# Altium project HIVE_BOARD.PrjPcb (part 5 of 6)

## Sheet HIVE_BOARD_ETHERNET.SchDoc
size Tabloid; SheetNumber: 9; SheetTotal: 12; Size: 11x17; Sheet_Name: ETHERNET
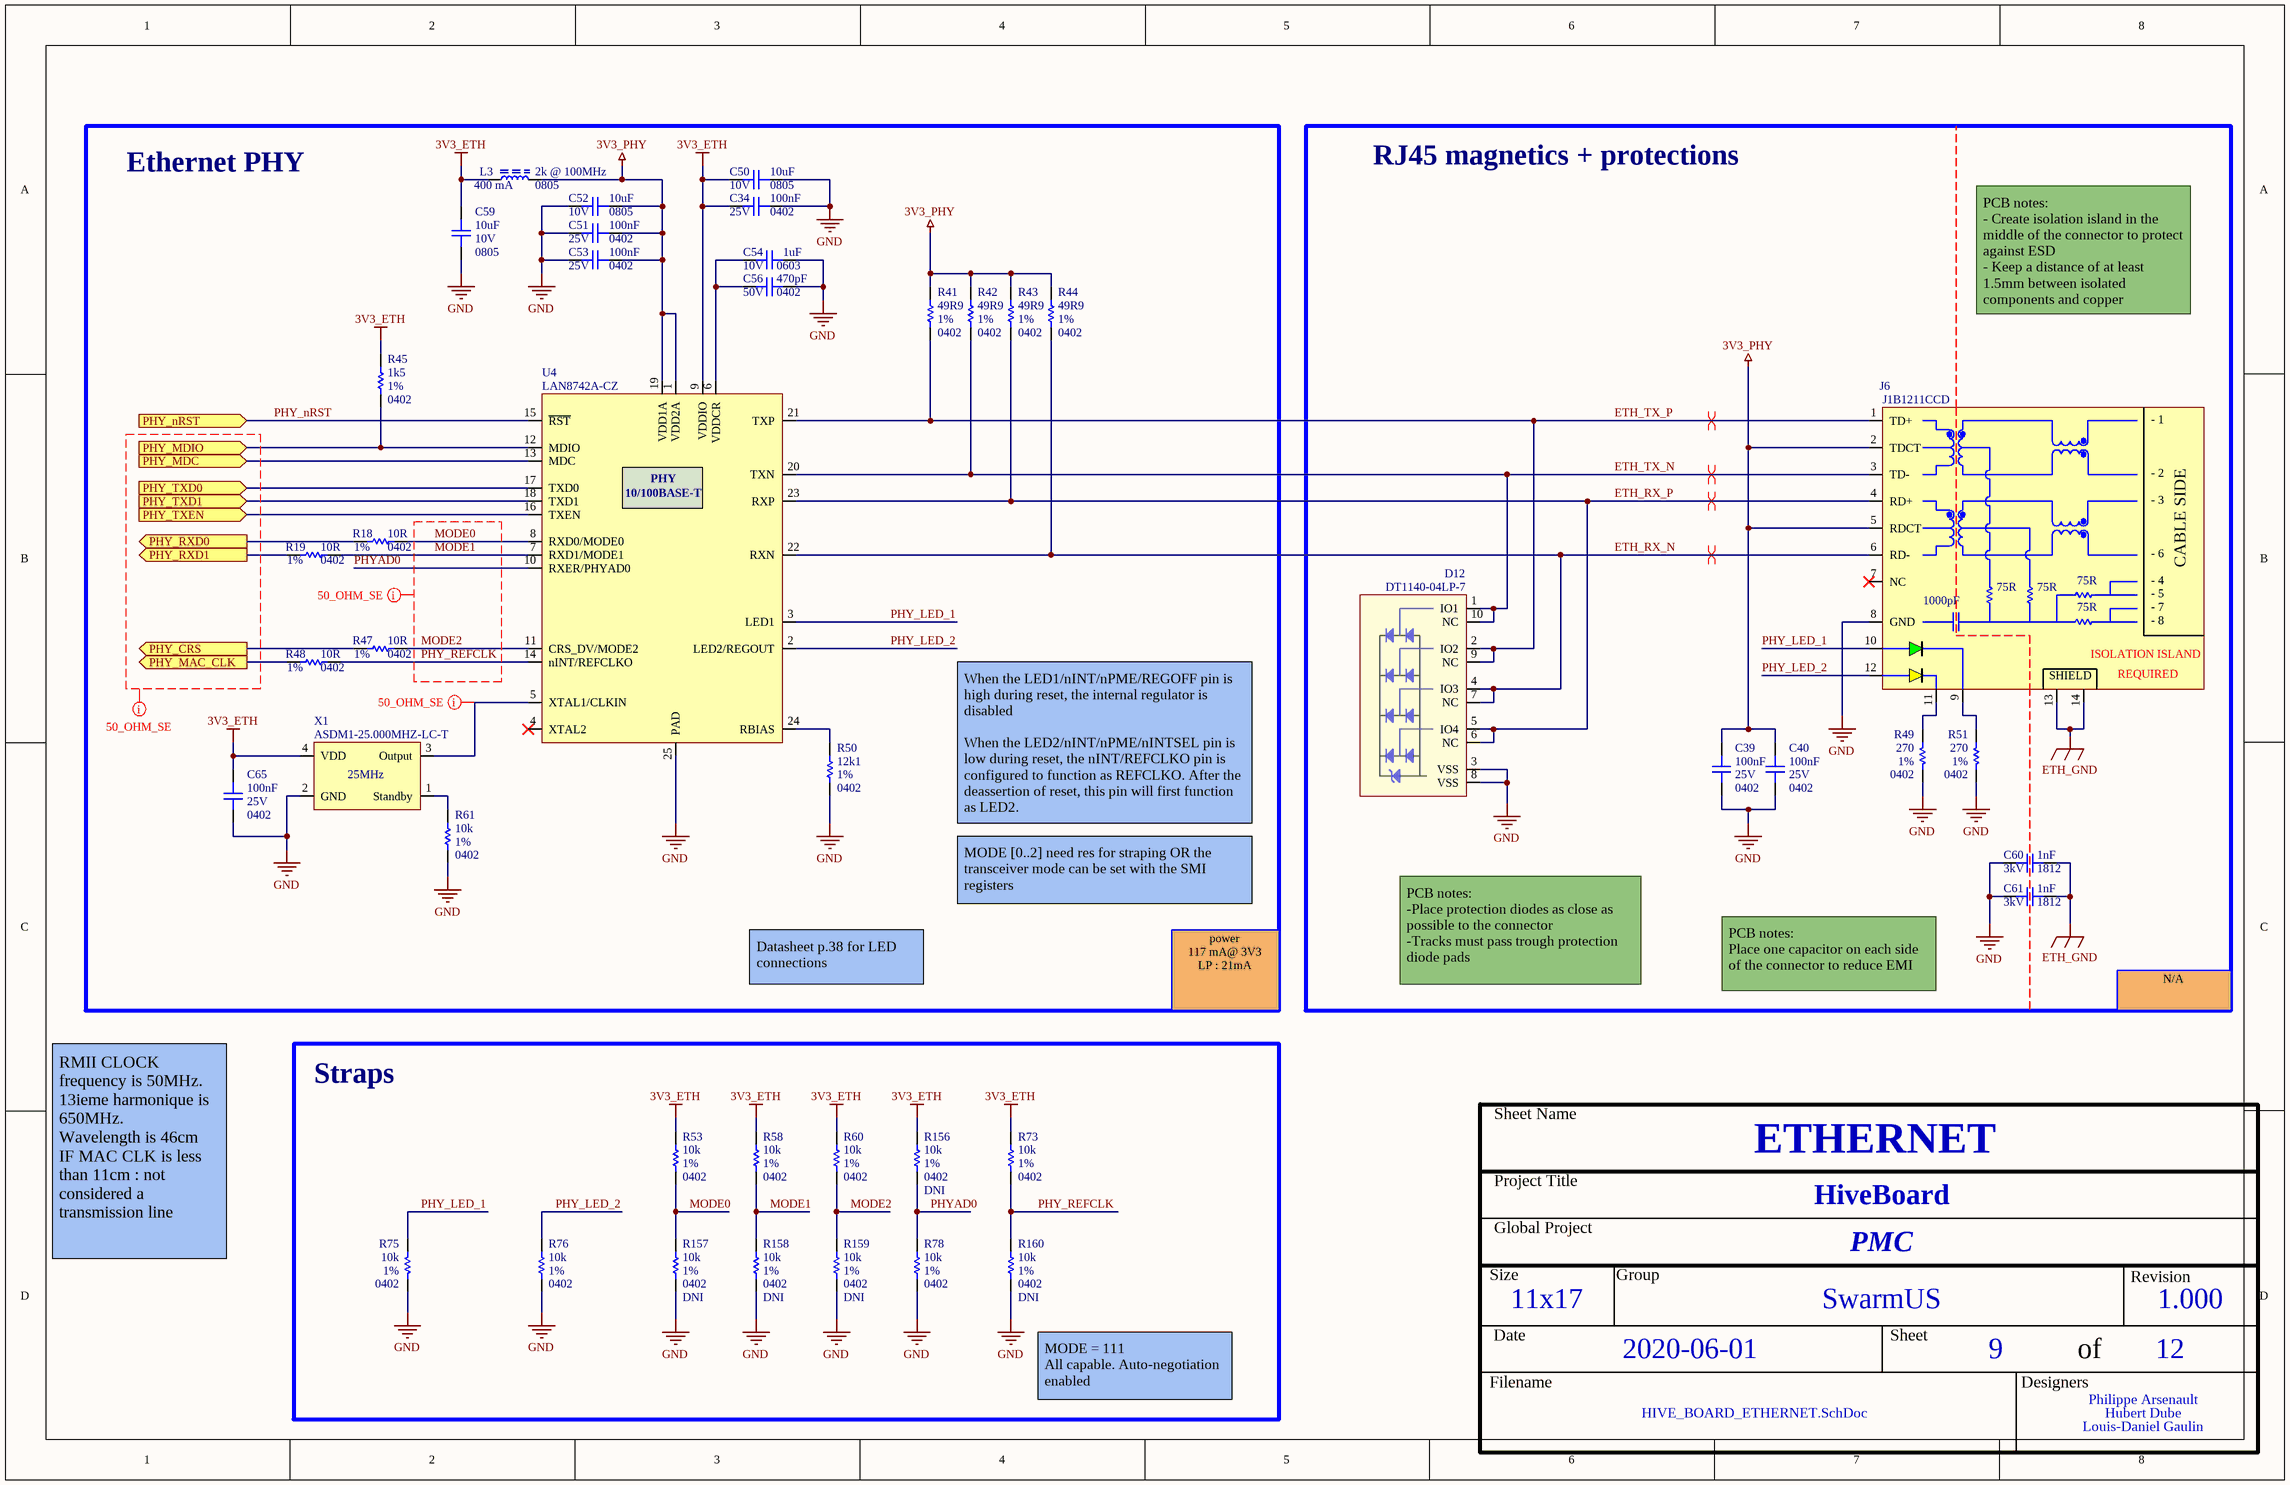
[diagram p8: HIVE_BOARD_ETHERNET.SchDoc]

### Parts
C34  value 100nF  Package: 0402  Voltage Rating: 25V  [CAP_CER_0402]  (hidden comment: CGA2B3X7R1E104K050BB)
C39  value 100nF  Package: 0402  Voltage Rating: 25V  [CAP_CER_0402]  (hidden comment: CGA2B3X7R1E104K050BB)
C40  value 100nF  Package: 0402  Voltage Rating: 25V  [CAP_CER_0402]  (hidden comment: CGA2B3X7R1E104K050BB)
C50  value 10uF  Package: 0805  Voltage Rating: 10V  [CAP_CER_0805]  (hidden comment: LMK212BJ106KG-T)
C51  value 100nF  Package: 0402  Voltage Rating: 25V  [CAP_CER_0402]  (hidden comment: CGA2B3X7R1E104K050BB)
C52  value 10uF  Package: 0805  Voltage Rating: 10V  [CAP_CER_0805]  (hidden comment: LMK212BJ106KG-T)
C53  value 100nF  Package: 0402  Voltage Rating: 25V  [CAP_CER_0402]  (hidden comment: CGA2B3X7R1E104K050BB)
C54  value 1uF  Package: 0603  Voltage Rating: 10V  [CAP_CER_0603]  (hidden comment: C0603C105K8PACTU)
C56  value 470pF  Package: 0402  Voltage Rating: 50V  [CAP_CER_0402]  (hidden comment: CC0402KRX7R9BB471)
C59  value 10uF  Package: 0805  Voltage Rating: 10V  [CAP_CER_0805]  (hidden comment: LMK212BJ106KG-T)
C60  value 1nF  Package: 1812  Voltage Rating: 3kV  [CAP_CER_1812]  (hidden comment: 885342211009)
C61  value 1nF  Package: 1812  Voltage Rating: 3kV  [CAP_CER_1812]  (hidden comment: 885342211009)
C65  value 100nF  Package: 0402  Voltage Rating: 25V  [CAP_CER_0402]  (hidden comment: CGA2B3X7R1E104K050BB)
D12  DT1140-04LP-7  [TVS_DATA_DT1140-04LP-7]
J6  J1B1211CCD  [CON_ETH_J1B1211CCD_WIZ]
L3  value 2k @ 100MHz  Current Rating: 400 mA  Package: 0805  [FER_0805]  (hidden comment: MMZ2012Y202BT000)
R18  value 10R  Tolerance: 1%  Package: 0402  [RES_0402]  (hidden comment: RMCF0402FT10R0)
R19  value 10R  Tolerance: 1%  Package: 0402  [RES_0402]  (hidden comment: RMCF0402FT10R0)
R41  value 49R9  Tolerance: 1%  Package: 0402  [RES_0402]  (hidden comment: RC0402FR-0749R9L)
R42  value 49R9  Tolerance: 1%  Package: 0402  [RES_0402]  (hidden comment: RC0402FR-0749R9L)
R43  value 49R9  Tolerance: 1%  Package: 0402  [RES_0402]  (hidden comment: RC0402FR-0749R9L)
R44  value 49R9  Tolerance: 1%  Package: 0402  [RES_0402]  (hidden comment: RC0402FR-0749R9L)
R45  value 1k5  Tolerance: 1%  Package: 0402  [RES_0402]  (hidden comment: RC0402FR-071K5L)
R47  value 10R  Tolerance: 1%  Package: 0402  [RES_0402]  (hidden comment: RMCF0402FT10R0)
R48  value 10R  Tolerance: 1%  Package: 0402  [RES_0402]  (hidden comment: RMCF0402FT10R0)
R49  value 270  Tolerance: 1%  Package: 0402  [FER_0402]  (hidden comment: RC0402FR-07270RL)
R50  value 12k1  Tolerance: 1%  Package: 0402  [RES_0402]  (hidden comment: RC0402FR-0712K1L)
R51  value 270  Tolerance: 1%  Package: 0402  [FER_0402]  (hidden comment: RC0402FR-07270RL)
R53  value 10k  Tolerance: 1%  Package: 0402  [RES_0402]  (hidden comment: RC0402FR-0710KL)
R58  value 10k  Tolerance: 1%  Package: 0402  [RES_0402]  (hidden comment: RC0402FR-0710KL)
R60  value 10k  Tolerance: 1%  Package: 0402  [RES_0402]  (hidden comment: RC0402FR-0710KL)
R61  value 10k  Tolerance: 1%  Package: 0402  [RES_0402]  (hidden comment: RC0402FR-0710KL)
R73  value 10k  Tolerance: 1%  Package: 0402  [RES_0402]  (hidden comment: RC0402FR-0710KL)
R75  value 10k  Tolerance: 1%  Package: 0402  [RES_0402]  (hidden comment: RC0402FR-0710KL)
R76  value 10k  Tolerance: 1%  Package: 0402  [RES_0402]  (hidden comment: RC0402FR-0710KL)
R78  value 10k  Tolerance: 1%  Package: 0402  [RES_0402]  (hidden comment: RC0402FR-0710KL)
R156  value 10k  Tolerance: 1%  Assembly Note: DNI  Package: 0402  [RES_0402]  (hidden comment: RC0402FR-0710KL)
R157  value 10k  Tolerance: 1%  Assembly Note: DNI  Package: 0402  [RES_0402]  (hidden comment: RC0402FR-0710KL)
R158  value 10k  Tolerance: 1%  Assembly Note: DNI  Package: 0402  [RES_0402]  (hidden comment: RC0402FR-0710KL)
R159  value 10k  Tolerance: 1%  Assembly Note: DNI  Package: 0402  [RES_0402]  (hidden comment: RC0402FR-0710KL)
R160  value 10k  Tolerance: 1%  Assembly Note: DNI  Package: 0402  [RES_0402]  (hidden comment: RC0402FR-0710KL)
U4  LAN8742A-CZ  [COM_ETH_LAN8742A-CZ-TR]
X1  ASDM1-25.000MHZ-LC-T  [OSC_CRY_ASDM1-25.000MHZ-LC-T]

### Blocks framed on the sheet
Ethernet PHY: C34 C50-C54 C56 C59 C65 L3 R18 R19 R41-R45 R47 R48 R50 R61 U4 X1
RJ45 magnetics + protections: C39 C40 C60 C61 D12 J6 R49 R51
Straps: R53 R58 R60 R73 R75 R76 R78 R156-R160

### Ports
PHY_CRS (out), PHY_MAC_CLK (out), PHY_MDC (in), PHY_MDIO (in), PHY_nRST (in), PHY_RXD0 (out), PHY_RXD1 (out), PHY_TXD0 (in), PHY_TXD1 (in), PHY_TXEN (in)

### Nets
3V3_ETH: C34.2 C50.2 C59.2 C65.1 L3.1 R45.2 R53.2 R58.2 R60.2 R73.2 R156.2 U4.9(VDDIO) X1.4(VDD)
3V3_PHY: C39.1 C40.1 C51.1 C52.1 C53.1 J6.2(TDCT) J6.5(RDCT) L3.2 R41.2 R42.2 R43.2 R44.2 U4.1(VDD2A) U4.19(VDD1A)
ETH_GND: C60.1 C61.1 J6.13(SHIELD) J6.14
GND: C34.1 C39.2 C40.2 C50.1 C51.2 C52.2 C53.2 C54.1 C56.1 C59.1 C60.2 C61.2 C65.2 D12.3(VSS) D12.8(VSS) J6.8(GND) R49.1 R50.1 R51.1 R61.1 R75.1 R76.1 R78.1 R157.1 R158.1 R159.1 R160.1 U4.25(PAD) X1.2(GND)
ETH_RX_N: D12.4(IO3) D12.7(NC) J6.6(RD-) R44.1 U4.22(RXN)
ETH_RX_P: D12.5(IO4) D12.6(NC) J6.4(RD+) R43.1 U4.23(RXP)
ETH_TX_N: D12.1(IO1) D12.10(NC) J6.3(TD-) R42.1 U4.20(TXN)
ETH_TX_P: D12.2(IO2) D12.9(NC) J6.1(TD+) R41.1 U4.21(TXP)
MODE0: R18.1 R53.1 R157.2 U4.8(RXD0/MODE0)
MODE1: R19.1 R58.1 R158.2 U4.7(RXD1/MODE1)
MODE2: R47.1 R60.1 R159.2 U4.11(CRS_DV/MODE2)
PHY_LED_1: J6.10(LED1_A) R75.2 U4.3(LED1)
PHY_LED_2: J6.12 R76.2 U4.2(LED2/REGOUT)
PHY_nRST: U4.15(~{RST}) ; port PHY_nRST
PHY_REFCLK: R48.1 R73.1 R160.2 U4.14(nINT/REFCLKO)
PHYAD0: R78.2 R156.1 U4.10(RXER/PHYAD0)
NetC54_2: C54.2 C56.2 U4.6(VDDCR)
NetJ6_9: J6.9(LED1_K) R51.2
NetJ6_11: J6.11 R49.2
NetR18_2: R18.2 ; port PHY_RXD0
NetR19_2: R19.2 ; port PHY_RXD1
NetR45_1: R45.1 U4.12(MDIO) ; port PHY_MDIO
NetR47_2: R47.2 ; port PHY_CRS
NetR48_2: R48.2 ; port PHY_MAC_CLK
NetR50_2: R50.2 U4.24(RBIAS)
NetR61_2: R61.2 X1.1(Standby)
NetR165_1: U4.17(TXD0) ; port PHY_TXD0
NetR167_1: U4.18(TXD1) ; port PHY_TXD1
NetU1_29: U4.13(MDC) ; port PHY_MDC
NetU1_67: U4.16(TXEN) ; port PHY_TXEN
NetU4_5: U4.5(XTAL1/CLKIN) X1.3(Output)

Not connected (* = marked no-connect by the designer): J6 7(NC)*; U4 4(XTAL2)*

### Layout directives
differential pair; differential pair class DIFF_100: ETH_RX_N, ETH_RX_P, ETH_TX_N, ETH_TX_P
net class SE_50: (no net found under the mark), MODE0, MODE1, MODE2, NetU4_5, PHY_REFCLK

### Notes on the sheet
- PCB notes:
  - Create isolation island in the middle of the connector to protect against ESD
  - Keep a distance of at least 1.5mm between isolated components and copper
- When the LED1/nINT/nPME/REGOFF pin is high during reset, the internal regulator is disabled
  When the LED2/nINT/nPME/nINTSEL pin is low during reset, the nINT/REFCLKO pin is configured to function as REFCLKO. After the deassertion of reset, this pin will first function as LED2.
- MODE [0..2] need res for straping OR the transceiver mode can be set with the SMI registers
- Datasheet p.38 for LED connections
- power
  117 mA@ 3V3
  LP : 21mA
- PCB notes:
  -Place protection diodes as close as possible to the connector
  -Tracks must pass trough protection diode pads
- PCB notes:
  Place one capacitor on each side of the connector to reduce EMI
- N/A
- RMII CLOCK frequency is 50MHz. 13ieme harmonique is 650MHz.
  Wavelength is 46cm
  IF MAC CLK is less than 11cm : not considered a transmission line
- MODE = 111
  All capable. Auto-negotiation enabled
- Sheet Name
- Project Title
- Global Project
- Size
- Group
- Revision
- Date
- Sheet
- of
- Filename
- Designers
- (in symbol COM_ETH_LAN8742A-CZ) PHY; 10/100BASE-T
- (in symbol CON_ETH_J1B1211CCD) - 1; - 2; - 3; - 6; CABLE SIDE; 75R; - 4; - 5; 1000pF; - 7; - 8; ISOLATION ISLAND; REQUIRED
- (in symbol OSC_CRY_ASDM1-25.000MHZ-LC-T) 25MHz

### Library data of the parts
C34 C39 C40 C51 C53 C65 = CAP_CER_CGA2B3X7R1E104K050BB: CAP - CER 0.1µF 10% 25V X7R - 0402; Manufacturer #1: TDK Corporation; GRAMS Lib Spec: 2.8; Magnetic Material: Unknown; Polarized: NO; Assembly Type: SMD; CreatedBy/Date: Nicolas Roy 2018-11-07; Current Rating: *; HelpURL: https://product.tdk.com/info/en/catalog/datasheets/mlcc_automotive_general_en.pdf; Manufacturer #2: *; Note: *; Part Number #1: CGA2B3X7R1E104K050BB; Part Number #2: *; Power Max: *; Temperature: -55°C ~ 125°C; Tolerance: 10%; VerifiedBy: Nicolas V. (2019-01-22); Supplier 1: Digi-Key; Supplier Part Number 1: 445-6902-1-ND; Cryo: UNKNOWN
C50 C52 C59 = CAP_CER_LMK212BJ106KG-T: CAP - CER 10UF 10% 10V X5R - 0805; Manufacturer #1: Taiyo Yuden; GRAMS Lib Spec: 2.8; Magnetic Material: Unknown; Polarized: NO; Assembly Type: SMD; CreatedBy/Date: Caroline Paulin / 25 juillet 2018; Current Rating: *; HelpURL: https://www.yuden.co.jp/productdata/catalog/mlcc_all_e.pdf; Manufacturer #2: *; Note: *; Part Number #1: LMK212BJ106KG-T; Part Number #2: *; Power Max: *; Temperature: -55°C ~ 85°C; Tolerance: 10%; VerifiedBy: Nicolas V. (2019-01-22); Supplier 1: Digi-Key; Supplier Part Number 1: 587-1300-1-ND; Cryo: UNKNOWN
C54 = CAP_CER_C0603C105K8PACTU: CAP - CER 1uF 10V 10% X5R - 0603; Manufacturer #1: KEMET; GRAMS Lib Spec: 2.8; Magnetic Material: Unknown; Polarized: NO; Tolerance: 10%; Current Rating: *; Power Max: *; HelpURL: https://content.kemet.com/datasheets/KEM_C1006_X5R_SMD.pdf; CreatedBy/Date: Hubert Dube - 21/07/20; VerifiedBy: Louis-Daniel Gaulin - 21/07/20; Temperature: -55°C ~ 85°C; Manufacturer #2: *; Assembly Type: SMD; Part Number #2: *; Part Number #1: C0603C105K8PACTU; Cryo: UNKNOWN; Supplier 1: Digi-Key; Supplier Part Number 1: 399-3118-1-ND
C56 = CAP_CER_CC0402KRX7R9BB471: CAP - CER 470pF 10% 50V X7R - 0402; Manufacturer #1: Yageo; GRAMS Lib Spec: 2.8; Magnetic Material: Unknown; Polarized: NO; Assembly Type: SMD; CreatedBy/Date: Nicolas Roy 2018-10-17; Current Rating: *; HelpURL: http://www.yageo.com/documents/recent/UPY-GPHC_X7R_6.3V-to-50V_18.pdf; Manufacturer #2: *; Part Number #1: CC0402KRX7R9BB471; Part Number #2: *; Power Max: *; Temperature: -55°C ~ 125°C; Tolerance: 10%; VerifiedBy: Caroline Paulin - 18 janv 2019; Supplier 1: Digi-Key; Supplier Part Number 1: 311-1028-1-ND; Cryo: UNKNOWN
C60 C61 = CAP_CER_885342211009: CAP - CER 1000pF ±10% 3000V X7R; Manufacturer #1: Würth Elektronik; GRAMS Lib Spec: 2.8; Magnetic Material: Unknown; Polarized: No; Tolerance: 10%; Current Rating: *; Power Max: *; HelpURL: https://www.we-online.de/katalog/datasheet/885342211009.pdf; CreatedBy/Date: Hubert Dube - 03/02/2021; VerifiedBy: Philippe Asenault - 08-02-2021; Temperature: -55°C ~ 125°C; Manufacturer #2: *; Note: *; Assembly Type: SMD; Part Number #2: *; Part Number #1: 885342211009; Cryo: UNKNOWN; Supplier 1: Digi-Key; Supplier Part Number 1: 732-12109-1-ND
D12 = TVS_DATA_DT1140-04LP-7: TVS - DIODE 5.5V 10V - 10-UFDFN; Manufacturer #1: Diodes Incorporated; Value: 5.5V @ 1mA (Reverse Standoff); Voltage Rating: 6V (Breakdown); Current Rating: 6A (8/20µs); Power Max: 60W (8/20µs); GRAMS Lib Spec: 2.8; Note: Fooprint created from tpd4e05u06 (TI) for manufacturability (soldermask); Magnetic Material: Unknown; Polarized: Yes; Tolerance: -; HelpURL: https://www.diodes.com/assets/Datasheets/DT1140-04LP.pdf; CreatedBy/Date: Joël Lemay 2019-11-20; VerifiedBy: C.Paulin - 21/11/2019; Temperature: -55°C~85°C; Package: 10-UFDFN; Manufacturer #2: -; Assembly Type: SMD; Part Number #2: -; Part Number #1: DT1140-04LP-7; Supplier 1: Digi-Key; Supplier Part Number 1: DT1140-04LP-7DICT-ND; Cryo: UNKNOWN
J6 = CON_ETH_J1B1211CCD: CON_ETH - 1 Port RJ45 Magjack Connector Through Hole 10/100 Base-T, AutoMDIX / 350 µH minimum OCL with 8 mA bias current.; Manufacturer #1: WIZnet; Part Number #1: 1278-1052-ND; GRAMS Lib Spec: 2.8; Magnetic Material: Unknown; Polarized: Yes; Tolerance: *; Voltage Rating: *; Power Max: *; HelpURL: http://wizwiki.net/wiki/lib/exe/fetch.php?media=products:wiz550web:wiz550webds_kr:j1b1211ccd.pdf; CreatedBy/Date: Hubert Dube - 12/02/2021; VerifiedBy: Philippe Arsenault - 2021-03-10; Temperature: -40°C ~ 85°C; Assembly Type: SMD; Part Number #2: *; Cryo: UNKNOWN; Supplier 1: Digi-Key; Supplier Part Number 1: 1278-1052-ND
L3 = FER_MMZ2012Y202BT000: FER - FERRITE BEAD 2 KOHM @ 100 MHz 400 mA - 0805; Manufacturer #1: TDK Corporation; GRAMS Lib Spec: 2.8; Magnetic Material: Unknown; Polarized: No; Tolerance: *; Voltage Rating: *; Power Max: *; HelpURL: https://product.tdk.com/info/en/catalog/datasheets/beads_commercial_signal_mmz2012_en.pdf; CreatedBy/Date: Hubert Dube - 7/02/2021; VerifiedBy: Philippe Arsenault/ 2021-03-13; Temperature: -55°C ~ 125°C; Assembly Type: SMD; Part Number #2: *; Part Number #1: MMZ2012Y202BT000; Cryo: UNKNOWN; Supplier 1: Digi-Key; Supplier Part Number 1: 445-1561-1-ND
R18 R19 R47 R48 = RES_RMCF0402FT10R0: RES - 10R 1% 1/16W - 0402; Manufacturer #1: Stackpole Electronics Inc.; Current Rating: 1A; GRAMS Lib Spec: 2.8; Magnetic Material: Unknown; Polarized: No; Voltage Rating: 50V; Assembly Type: SMD; CreatedBy/Date: Joel Lemay 2018-07-04; HelpURL: https://www.seielect.com/Catalog/SEI-RMCF_RMCP.pdf; Manufacturer #2: Panasonic; Part Number #1: RMCF0402FT10R0; Part Number #2: ERJ-2RKF10R0X; Power Max: 1/16W; Temperature: -55°C ~ 155°C; VerifiedBy: Caroline Paulin - 6 sept 2018; Supplier 1: Digi-Key; Supplier Part Number 1: RMCF0402FT10R0CT-ND; Cryo: UNKNOWN
R41-R44 = RES_RC0402FR-0749R9L: RES - 49.9 R ±1% 1/16W -  0402; Manufacturer #1: Yageo; GRAMS Lib Spec: 2.8c; Magnetic Material: Unknown; Polarized: No; Voltage Rating: 50V; Assembly Type: SMD; CreatedBy/Date: Hubert Dubé - 3/02/2020; Current Rating: *; HelpURL: https://www.yageo.com/upload/media/product/productsearch/datasheet/rchip/PYu-RC_Group_51_RoHS_L_11.pdf; Manufacturer #2: *; Note: *; Part Number #1: RC0402FR-0749R9L; Part Number #2: *; Power Max: 1/16W; Temperature: -55°C ~ 155°C; VerifiedBy: Philippe Arsenault/2021-02-08; Supplier 1: Digi-Key; Supplier Part Number 1: 311-49.9LRCT-ND
R45 = RES_RC0402FR-071K5L: RES - 1.5K 1% 1/16W - 0402; Manufacturer #1: Yageo; GRAMS Lib Spec: 2.8c; Magnetic Material: Unknown; Polarized: No; Voltage Rating: 50V; Assembly Type: SMD; CreatedBy/Date: Philippe Arsenault/21 Janvier 2020; Current Rating: -; HelpURL: https://www.yageo.com/upload/media/product/productsearch/datasheet/rchip/PYu-RC_Group_51_RoHS_L_10.pdf; Manufacturer #2: -; Note: -; Part Number #1: RC0402FR-071K5L; Part Number #2: -; Power Max: 1/16W; Temperature: -55°C ~ 155°C; VerifiedBy: C.Paulin - 28/01/2020; Supplier 1: Digi-Key; Supplier Part Number 1: 311-1.50KLRCT-ND; Cryo: UNKNOWN
R49 R51 = RES_RC0402FR-07270RL: RES - 270R 1% 1/16W - 0402; Manufacturer #1: Yageo; GRAMS Lib Spec: 2.8c; Magnetic Material: Unknown; Polarized: No; Voltage Rating: 50V; Assembly Type: SMD; CreatedBy/Date: Philippe Arsenault 2020-07-24; Current Rating: *; HelpURL: https://www.yageo.com/upload/media/product/productsearch/datasheet/rchip/PYu-RC_Group_51_RoHS_L_10.pdf; Manufacturer #2: *; Note: *; Part Number #1: RC0402FR-07270RL; Part Number #2: *; Power Max: 1/16W; Temperature: -55°C ~ 155°C; VerifiedBy: Louis-Daniel Gaulin / 03-10-2020; Supplier 1: Digi-Key; Supplier Part Number 1: 311-270LRCT-ND
R50 = RES_RC0402FR-0712K1L: RES - 12K1 ±1% 1/16W - 0402; Manufacturer #1: Yageo; GRAMS Lib Spec: 2.8c; Magnetic Material: Unknown; Polarized: No; Voltage Rating: 50V; Assembly Type: SMD; CreatedBy/Date: Hubert Dubé - 7/02/2020; Current Rating: *; HelpURL: https://www.yageo.com/upload/media/product/productsearch/datasheet/rchip/PYu-RC_Group_51_RoHS_L_11.pdf; Manufacturer #2: *; Note: *; Part Number #1: RC0402FR-0712K1L; Part Number #2: *; Power Max: 1/16W; Temperature: -55°C ~ 155°C; VerifiedBy: Philippe Arsenault/2021-02-08; Supplier 1: Digi-Key; Supplier Part Number 1: 311-12.1KLRCT-ND
R53 R58 R60 R61 R73 R75 R76 R78 R156-R160 = RES_RC0402FR-0710KL: RES - 10K OHMS 1% 1/16W - 0402; Manufacturer #1: Yageo; GRAMS Lib Spec: 2.8; Magnetic Material: UNKNOWN; Polarized: NO; Voltage Rating: 50V; Assembly Type: SMD; CreatedBy/Date: Nicolas V. (2018-11-20); Current Rating: *; HelpURL: http://www.yageo.com/documents/recent/PYu-RC_Group_51_RoHS_L_9.pdf; Manufacturer #2: *; Note: *; Part Number #1: RC0402FR-0710KL; Part Number #2: *; Power Max: 1/16W; Temperature: -55°C ~ 155°C; VerifiedBy: Nicolas V. (2018-11-20); Supplier 1: Digi-Key; Supplier Part Number 1: 311-10.0KLRCT-ND; Cryo: UNKNOWN
U4 = COM_ETH_LAN8742A-CZ: COM_ETH_ Ethernet PHY 1/1 Transceiver  Ethernet 24-SQFN (4x4) 10/100 BASE-T; Manufacturer #1: Microchip Technology; Voltage Rating: 1.6 ~ 3.6V; GRAMS Lib Spec: 2.7; Magnetic Material: Unknown; Polarized: Yes; Value: *; Tolerance: *; Current Rating: *; Power Max: *; HelpURL: https://ww1.microchip.com/downloads/en/DeviceDoc/DS_LAN8742_00001989A.pdf; VerifiedBy: Philippe Arsenault 2021-03-10; Temperature: 0°C ~ 70°C; Package: 24-SQFN (4x4); Manufacturer #2: *; Note: *; Assembly Type: SMD; Part Number #2: *; Part Number #1: LAN8742A-CZ; CreatedBy/Date: Hubert Dube -  28/01/2021; Supplier 1: Digi-Key; Supplier Part Number 1: LAN8742A-CZ-ND
X1 = OSC_CRY_ASDM1-25.000MHZ-LC-T: OSC_CRY - 25MHz +-50ppm LVCMOS Crystal; Manufacturer #1: Abracon LLC; Voltage Rating: 3.0 ~ 3.6V; Current Rating: 15mA; Power Max: 50mW; GRAMS Lib Spec: 2.8; Magnetic Material: Unknown; Polarized: YES; Value: 25.000MHz; HelpURL: https://abracon.com/Oscillators/ASDM.pdf; CreatedBy/Date: Philippe Arsenault/2021-04-07; VerifiedBy: Louis-Daniel Gaulin / 08-04-2021; Temperature: -40°C ~ 85°C; Package: 4-SMD; Assembly Type: SMD; Part Number #1: ASDM1-25.000MHZ-LC-T; Supplier 1: Digi-Key; Supplier Part Number 1: 535-9792-1-ND

## Sheet HIVE_BOARD_WIRELESS.SchDoc
size Tabloid; SheetNumber: 11; SheetTotal: 12; Sheet_Name: WIRELESS; Size: 11x17
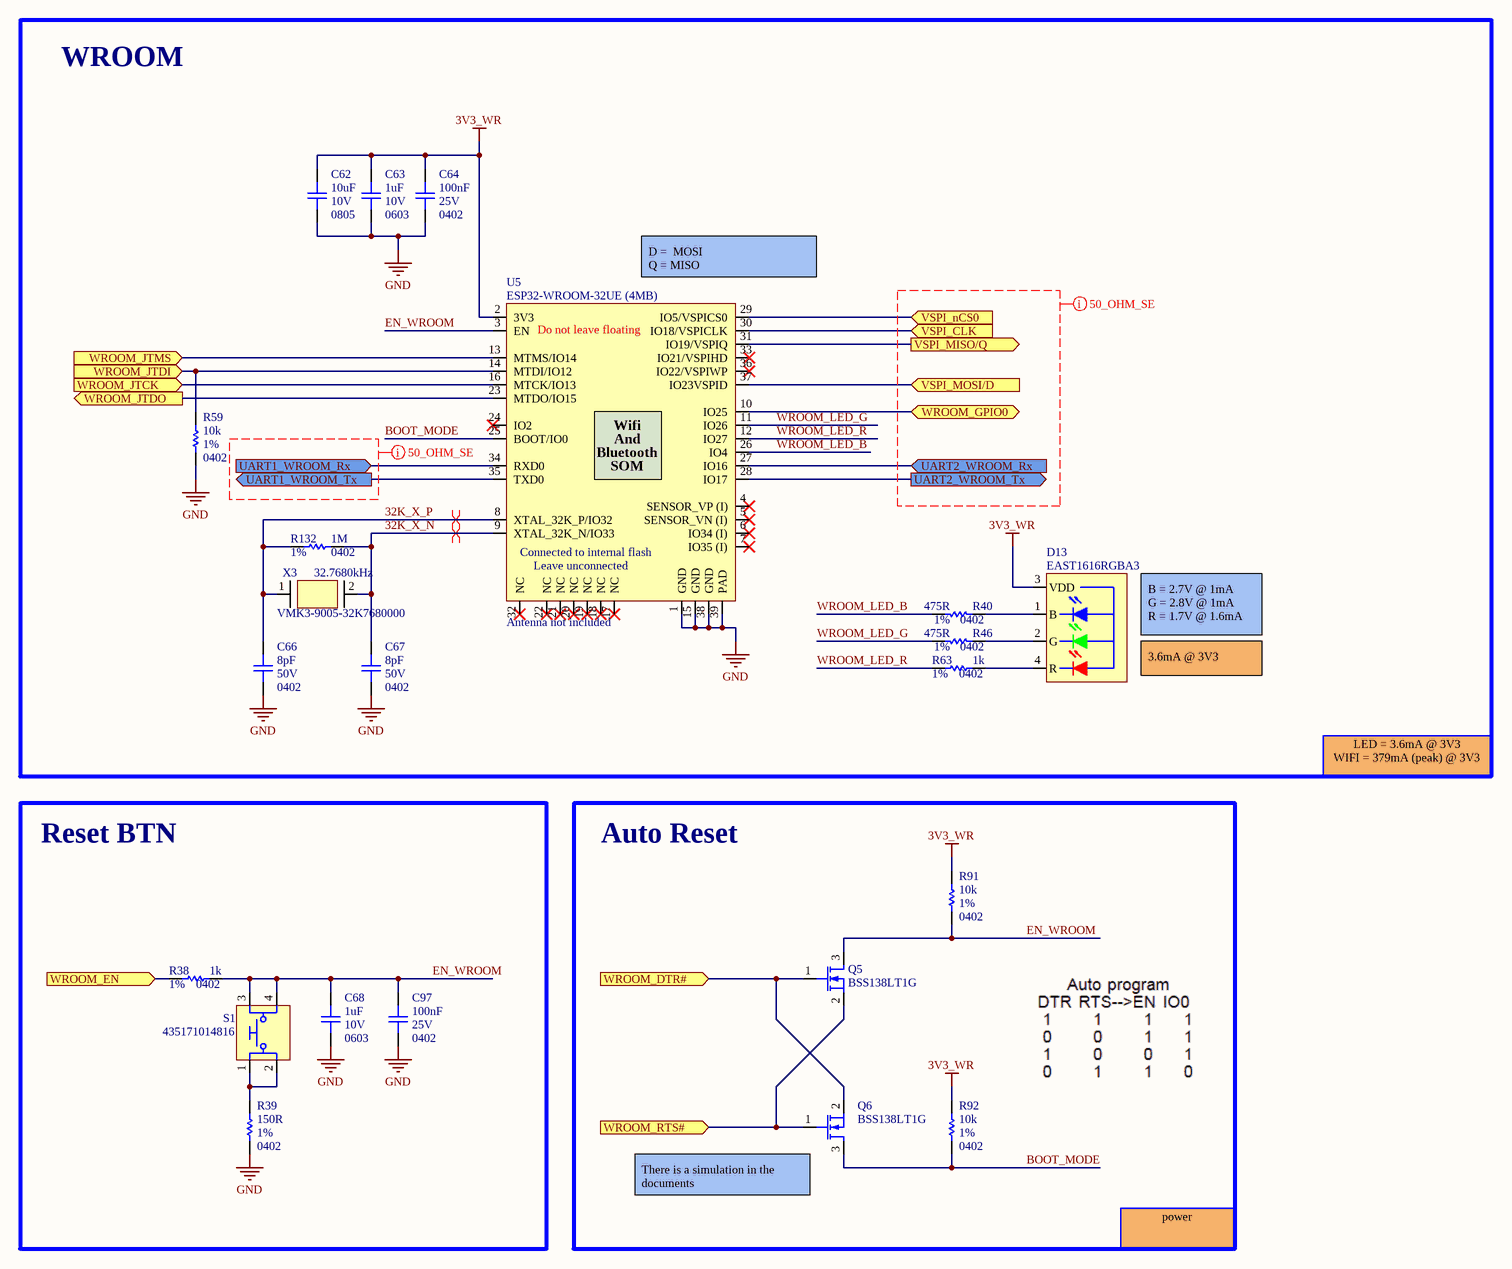
[diagram p9: HIVE_BOARD_WIRELESS.SchDoc]

### Parts
C62  value 10uF  Package: 0805  Voltage Rating: 10V  [CAP_CER_0805]  (hidden comment: LMK212BJ106KG-T)
C63  value 1uF  Package: 0603  Voltage Rating: 10V  [CAP_CER_0603]  (hidden comment: C0603C105K8PACTU)
C64  value 100nF  Package: 0402  Voltage Rating: 25V  [CAP_CER_0402]  (hidden comment: CGA2B3X7R1E104K050BB)
C66  value 8pF  Package: 0402  Voltage Rating: 50V  [CAP_CER_0402]  (hidden comment: CC0402DRNPO9BN8R0)
C67  value 8pF  Package: 0402  Voltage Rating: 50V  [CAP_CER_0402]  (hidden comment: CC0402DRNPO9BN8R0)
C68  value 1uF  Package: 0603  Voltage Rating: 10V  [CAP_CER_0603]  (hidden comment: C0603C105K8PACTU)
C97  value 100nF  Package: 0402  Voltage Rating: 25V  [CAP_CER_0402]  (hidden comment: CGA2B3X7R1E104K050BB)
D13  EAST1616RGBA3  [DIO_EAST1616RGBA3]
Q5  BSS138LT1G  [TRX_NMOS_BSS138LT1G]
Q6  BSS138LT1G  [TRX_NMOS_BSS138LT1G]
R38  value 1k  Tolerance: 1%  Package: 0402  [RES_0402]  (hidden comment: RC0402FR-071KL)
R39  value 150R  Tolerance: 1%  Package: 0402  [RES_0402]  (hidden comment: RC0402FR-07150RL)
R40  value 475R  Tolerance: 1%  Package: 0402  [RES_0402]  (hidden comment: ERJ-2RKF4750X)
R46  value 475R  Tolerance: 1%  Package: 0402  [RES_0402]  (hidden comment: ERJ-2RKF4750X)
R59  value 10k  Tolerance: 1%  Package: 0402  [RES_0402]  (hidden comment: RC0402FR-0710KL)
R63  value 1k  Tolerance: 1%  Package: 0402  [RES_0402]  (hidden comment: RC0402FR-071KL)
R91  value 10k  Tolerance: 1%  Package: 0402  [RES_0402]  (hidden comment: RC0402FR-0710KL)
R92  value 10k  Tolerance: 1%  Package: 0402  [RES_0402]  (hidden comment: RC0402FR-0710KL)
R132  value 1M  Tolerance: 1%  Package: 0402  [RES_0402]  (hidden comment: RC0402FR-071ML)
S1  435171014816  [SWI_TACT_435171014816]
U5  ESP32-WROOM-32UE (4MB)  Note: Antenna not included  [COM_ESP32-WROOM-32UE(8MB)]
X3  VMK3-9005-32K7680000  value 32.7680kHz  [CRY_VMK3-9005-32K7680000]

### Blocks framed on the sheet
WROOM: C62-C64 C66 C67 D13 R40 R46 R59 R63 R132 U5 X3
Reset BTN: C68 C97 R38 R39 S1
Auto Reset: Q5 Q6 R91 R92

### Ports
UART1_WROOM_Rx (in), UART1_WROOM_Tx (out), UART2_WROOM_Rx (in), UART2_WROOM_Tx (out), VSPI_CLK (in), VSPI_MISO/Q (out), VSPI_MOSI/D (in), VSPI_nCS0 (in), WROOM_DTR# (in), WROOM_EN (in), WROOM_GPIO0 (bidir), WROOM_JTCK (in), WROOM_JTDI (in), WROOM_JTDO (out), WROOM_JTMS (in), WROOM_RTS# (in)

### Nets
3V3_WR: C62.2 C63.1 C64.2 D13.3(VDD) R91.2 R92.2 U5.2(3V3)
GND: C62.1 C63.2 C64.1 C66.1 C67.1 C68.2 C97.1 R39.1 R59.1 U5.1(GND) U5.15(GND) U5.38(GND) U5.39(PAD)
32K_X_N: C67.2 R132.1 U5.9(XTAL_32K_N/IO33) X3.2(Out/In)
32K_X_P: C66.2 R132.2 U5.8(XTAL_32K_P/IO32) X3.1(In/Out)
BOOT_MODE: Q6.3(D) R92.1 U5.25(BOOT/IO0)
EN_WROOM: C68.1 C97.2 Q5.3(D) R38.1 R91.1 S1.3 S1.4 U5.3(EN)
WROOM_LED_B: R40.2 U5.26(IO4)
WROOM_LED_G: R46.2 U5.11(IO26)
WROOM_LED_R: R63.2 U5.12(IO27)
NetD13_1: D13.1(B) R40.1
NetD13_2: D13.2(G) R46.1
NetD13_4: D13.4(R) R63.1
NetQ5_1: Q5.1(G) Q6.2(S) ; port WROOM_DTR#
NetQ5_2: Q5.2(S) Q6.1(G) ; port WROOM_RTS#
NetR38_2: R38.2 ; port WROOM_EN
NetR39_2: R39.2 S1.1 S1.2
NetR55_1: U5.16(MTCK/IO13) ; port WROOM_JTCK
NetR56_1: R59.2 U5.14(MTDI/IO12) ; port WROOM_JTDI
NetR57_1: U5.23(MTDO/IO15) ; port WROOM_JTDO
NetR62_1: U5.13(MTMS/IO14) ; port WROOM_JTMS
NetR169_1: U5.30(IO18/VSPICLK) ; port VSPI_CLK
NetR170_1: U5.37(IO23VSPID) ; port VSPI_MOSI/D
NetU1_1: U5.10(IO25) ; port WROOM_GPIO0
NetU1_22: U5.31(IO19/VSPIQ) ; port VSPI_MISO/Q
NetU1_136: U5.29(IO5/VSPICS0) ; port VSPI_nCS0
NetU1_138: U5.28(IO17) ; port UART2_WROOM_Tx
NetU1_139: U5.27(IO16) ; port UART2_WROOM_Rx
NetU5_34: U5.34(RXD0) ; port UART1_WROOM_Rx
NetU5_35: U5.35(TXD0) ; port UART1_WROOM_Tx

Not connected (* = marked no-connect by the designer): U5 4(SENSOR_VP_(I))* 5(SENSOR_VN_(I))* 6(IO34_(I))* 7(IO35_(I))* 17(NC)* 18(NC)* 19(NC)* 20(NC)* 21(NC)* 22(NC)* 24(IO2)* 32(NC)* 33(IO21/VSPIHD)* 36(IO22/VSPIWP)*

### Layout directives
differential pair; differential pair class DIFF_100: 32K_X_N, 32K_X_P
net class SE_50: (no net found under the mark)

### Notes on the sheet
- (near U5) D =  MOSI
  Q = MISO
- B = 2.7V @ 1mA
  G = 2.8V @ 1mA
  R = 1.7V @ 1.6mA
- 3.6mA @ 3V3
- LED = 3.6mA @ 3V3
  WIFI = 379mA (peak) @ 3V3
- (near Q6) There is a simulation in the documents
- power
- Sheet Name
- Project Title
- Global Project
- Size
- Group
- Revision
- Date
- Sheet
- of
- Filename
- Designers
- (in symbol COM_ESP32-WROOM-32UE(4MB)) Do not leave floating; Wifi; And; Bluetooth; SOM; Connected to internal flash; Leave unconnected

### Library data of the parts
C62 = CAP_CER_LMK212BJ106KG-T: as C50 on sheet HIVE_BOARD_ETHERNET; Assembly Type: SMD; CreatedBy/Date: Caroline Paulin / 25 juillet 2018; Current Rating: *; HelpURL: https://www.yuden.co.jp/productdata/catalog/mlcc_all_e.pdf; Manufacturer #2: *; Note: *; Part Number #1: LMK212BJ106KG-T; Part Number #2: *; Power Max: *; Temperature: -55°C ~ 85°C; Tolerance: 10%; VerifiedBy: Nicolas V. (2019-01-22); Supplier 1: Digi-Key; Supplier Part Number 1: 587-1300-1-ND; Cryo: UNKNOWN
C63 C68 = CAP_CER_C0603C105K8PACTU: as C54 on sheet HIVE_BOARD_ETHERNET; Tolerance: 10%; Current Rating: *; Power Max: *; HelpURL: https://content.kemet.com/datasheets/KEM_C1006_X5R_SMD.pdf; CreatedBy/Date: Hubert Dube - 21/07/20; VerifiedBy: Louis-Daniel Gaulin - 21/07/20; Temperature: -55°C ~ 85°C; Manufacturer #2: *; Assembly Type: SMD; Part Number #2: *; Part Number #1: C0603C105K8PACTU; Cryo: UNKNOWN; Supplier 1: Digi-Key; Supplier Part Number 1: 399-3118-1-ND
C64 C97 = CAP_CER_CGA2B3X7R1E104K050BB: as C34 on sheet HIVE_BOARD_ETHERNET; Assembly Type: SMD; CreatedBy/Date: Nicolas Roy 2018-11-07; Current Rating: *; HelpURL: https://product.tdk.com/info/en/catalog/datasheets/mlcc_automotive_general_en.pdf; Manufacturer #2: *; Note: *; Part Number #1: CGA2B3X7R1E104K050BB; Part Number #2: *; Power Max: *; Temperature: -55°C ~ 125°C; Tolerance: 10%; VerifiedBy: Nicolas V. (2019-01-22); Supplier 1: Digi-Key; Supplier Part Number 1: 445-6902-1-ND; Cryo: UNKNOWN
C66 C67 = CAP_CER_CC0402DRNPO9BN8R0: CAP - CER 8PF 50V C0G/NP0 - 0402; Manufacturer #1: Yageo; Tolerance: ±0.5pF; GRAMS Lib Spec: 2.8; Magnetic Material: Unknown; Polarized: NO; Current Rating: *; Power Max: *; HelpURL: https://www.yageo.com/upload/media/product/productsearch/datasheet/mlcc/UPY-GP_NP0_16V-to-50V_18.pdf; CreatedBy/Date: Hubert Dube - 04/10/20; VerifiedBy: Louis-Daniel Gaulin - 09/11/2020; Temperature: -55°C ~ 125°C; Manufacturer #2: *; Assembly Type: SMD; Part Number #2: *; Part Number #1: CC0402DRNPO9BN8R0; Cryo: UNKNOWN; Supplier 1: Digi-Key; Supplier Part Number 1: 311-1639-1-ND
D13 = DIO_EAST1616RGBA3: DIO - Red, Green, Blue LED Indication - Discrete 1.95V Red, 2.8V Green, 2.8V Blue 0606 (1616 Metric); Manufacturer #1: Everlight Electronics Co Ltd; Value: 24MHz; Tolerance: ±50ppm; Voltage Rating: 1.8 to 3.3V; Current Rating: 60mA; Power Max: 60mW; GRAMS Lib Spec: 2.8; Magnetic Material: Unknown; Polarized: Yes; HelpURL: https://everlightamericas.com/index.php?controller=attachment&id_attachment=1010; CreatedBy/Date: Hubert Dube - 26/02/2021; VerifiedBy: PA + Hubert Dube - 19/03/2021; Temperature: -40 ~ +85℃; Package: 4-SMD, No Lead; Manufacturer #2: *; Note: *; Assembly Type: SMD; Part Number #2: *; Part Number #1: EAST1616RGBA3; Cryo: UNKNOWN; Supplier 1: Digi-Key; Supplier Part Number 1: 1080-1550-1-ND
Q5 Q6 = TRX_NMOS_BSS138LT1G: TRX - NMOS - 50V 200MA - SOT−23-3; Manufacturer #1: ON Semiconductor; GRAMS Lib Spec: 2.8; Magnetic Material: Unknown; Polarized: Yes; Power Max: 225mW; Assembly Type: SMD; CreatedBy/Date: Joel Lemay 2018-06-15; Current Rating: 200mA; HelpURL: http://www.onsemi.com/pub/Collateral/BSS138LT1-D.PDF; Manufacturer #2: *; Package: SOT-23-3; Part Number #1: BSS138LT1G; Part Number #2: *; Supplier 1: Digi-Key; Supplier Part Number 1: BSS138LT1GOSCT-ND; Temperature: -55°C ~ 150°C; Tolerance: *; Value: *; VerifiedBy: Caroline Paulin - 6 sept 2018; Voltage Rating: 50V; Cryo: UNKNOWN
R38 R63 = RES_RC0402FR-071KL: RES - 1K OHM 1% 1/16W - 0402; Manufacturer #1: Yageo; GRAMS Lib Spec: 2.8; Magnetic Material: YES; Polarized: NO; Voltage Rating: 50V; Cryo: UNKNOWN; Assembly Type: SMD; CreatedBy/Date: Jonathan Bouchard 2018-07-05; Current Rating: *; HelpURL: http://www.yageo.com/documents/recent/PYu-RC_Group_51_RoHS_L_9.pdf; Manufacturer #2: *; Note: *; Part Number #1: RC0402FR-071KL; Part Number #2: *; Power Max: 1/16W; Temperature: -55°C ~ 155°C; VerifiedBy: Arnaud Samson 16-07-18; Supplier 1: Digi-Key; Supplier Part Number 1: 311-1.00KLRCT-ND
R39 = RES_RC0402FR-07150RL: as R135-R150 on sheet HIVE_BOARD_MISC; Assembly Type: SMD; CreatedBy/Date: Jonathan Bouchard 2019-03-25; Current Rating: *; HelpURL: http://www.yageo.com/documents/recent/PYu-RC_Group_51_RoHS_L_10.pdf; Manufacturer #2: *; Part Number #1: RC0402FR-07150RL; Part Number #2: *; Power Max: 1/16W; Temperature: -55°C ~ 155°C; VerifiedBy: Nicolas V. (2019-05-02); Supplier 1: Digi-Key; Supplier Part Number 1: 311-150LRCT-ND; Cryo: UNKNOWN
R40 R46 = RES_ERJ-2RKF4750X: RES - 475R 1% 1/10W- 0402; Manufacturer #1: Panasonic Electronic Components; GRAMS Lib Spec: 2.8; Power Max: 1/10W; Magnetic Material: Unknown; Polarized: No; Voltage Rating: 50V; Assembly Type: SMD; CreatedBy/Date: Keven Deslandes 2018-10-17; Current Rating: *; HelpURL: https://industrial.panasonic.com/cdbs/www-data/pdf/RDA0000/AOA0000C304.pdf; Manufacturer #2: *; Part Number #1: ERJ-2RKF4750X; Part Number #2: *; Temperature: -55°C ~ 155°C; VerifiedBy: Carolilne Paulin - 18/12/2018; Supplier 1: Digi-Key; Supplier Part Number 1: P475LCT-ND; Cryo: UNKNOWN
R59 R91 R92 = RES_RC0402FR-0710KL: as R53 on sheet HIVE_BOARD_ETHERNET; Assembly Type: SMD; CreatedBy/Date: Nicolas V. (2018-11-20); Current Rating: *; HelpURL: http://www.yageo.com/documents/recent/PYu-RC_Group_51_RoHS_L_9.pdf; Manufacturer #2: *; Note: *; Part Number #1: RC0402FR-0710KL; Part Number #2: *; Power Max: 1/16W; Temperature: -55°C ~ 155°C; VerifiedBy: Nicolas V. (2018-11-20); Supplier 1: Digi-Key; Supplier Part Number 1: 311-10.0KLRCT-ND; Cryo: UNKNOWN
R132 = RES_RC0402FR-071ML: RES - 1M 1% 1/16W - 0402; Manufacturer #1: Yageo; GRAMS Lib Spec: 2.8; Magnetic Material: Unknown; Polarized: No; Voltage Rating: 50V; Assembly Type: SMD; CreatedBy/Date: Keven Deslandes 2018-11-09; Current Rating: *; HelpURL: http://www.yageo.com/documents/recent/PYu-RC_Group_51_RoHS_L_10.pdf; Manufacturer #2: *; Part Number #1: RC0402FR-071ML; Part Number #2: *; Power Max: 1/16W; Temperature: -55°C ~ 155°C; VerifiedBy: Caroline Paulin - 7 janv 2019; Supplier 1: Digi-Key; Supplier Part Number 1: 311-1.00MLRCT-ND; Cryo: UNKNOWN
S1 = SWI_TACT_435171014816: SWI - SWITCH TACTILE SPST-NO 0.05A 12V -SMD; Manufacturer #1: Würth Elektronik; Current Rating: 50mA; Voltage rating: 12VDC; Polarized: No; Magnetic Material: UNKNOWN; GRAMS Lib Spec: 2.8; Manufacturer #2: *; Power Max: *; Value: SPST-NO; Part Number #1: 435171014816; Part Number #2: *; HelpURL: https://www.we-online.com/catalog/datasheet/435171014816.pdf; Supplier 1: Digi-Key; Supplier Part Number 1: 732-435171014816CT-ND; Assembly Type: SMD; Temperature: -40°C ~ 85°C; Package: SMD; CreatedBy/Date: Hubert Dube - 22/07/20; Tolerance: *; VerifiedBy: Louis-Daniel Gaulin / 12-11-2020; Cryo: UNKNOWN
U5 = COM_ESP32-WROOM-32UE(4MB): Bluetooth, WiFi 802.11b/g/n, Bluetooth v4.2 +EDR, Class 1, 2 and 3 Transceiver Module 2.4GHz ~ 2.5GHz Antenna Not Included, U.FL Surface Mount; Manufacturer #1: Espressif Systems; Voltage Rating: -0.3 to 3.6V; Current Rating: 1100mA; Power Max: 3.96W; GRAMS Lib Spec: 2.7; Magnetic Material: Unknown; Polarized: Yes; Value: *; Tolerance: *; HelpURL: https://www.espressif.com/sites/default/files/documentation/esp32-wroom-32e_esp32-wroom-32ue_datasheet_en.pdf; VerifiedBy: Philippe Arsenault/ 2021-03-11; Temperature: -40~85C; Package: 38-SMD MODULE; Manufacturer #2: *; Assembly Type: SMD; Part Number #2: *; Part Number #1: ESP32-WROOM-32UE (4MB); CreatedBy/Date: Hubert Dube -  25/02/2021; Supplier 1: Digi-Key; Supplier Part Number 1: 1965-ESP32-WROOM-32UE(4MB)TR-ND
X3 = CRY_VMK3-9005-32K7680000: CRY - 32.768KHZ tol:20ppm  - 2-SMD; Manufacturer #1: Microchip Technology; Magnetic Material: Unknown; Note: The capacitance is unclear - migthcause problems; Polarized: No; GRAMS Lib Spec: 2.8c; Tolerance: ±20ppm; Assembly Type: SMD; Current Rating: *; Manufacturer #2: *; Part Number #1: VMK3-9005-32K7680000; Part Number #2: *; Package: 2-SMD, No Lead; Power Max: *; Voltage rating: *; Temperature: -40°C ~ 85°C; HelpURL: https://www.vectron.com/products/crystals/VMK3_VMK4.pdf; CreatedBy/Date: Louis-Daniel Gaulin / 08-04-2021; VerifiedBy: Philippe Arsenault/2021-04-15; Cryo: UNKNOWN; Supplier 1: Digi-Key; Supplier Part Number 1: 150-VMK3-9005-32K7680000CT-ND

## Sheet HIVE_BOARD_USB.SchDoc
size Tabloid; SheetNumber: 8; SheetTotal: 12; Sheet_Name: USB Hub; Size: 11x17
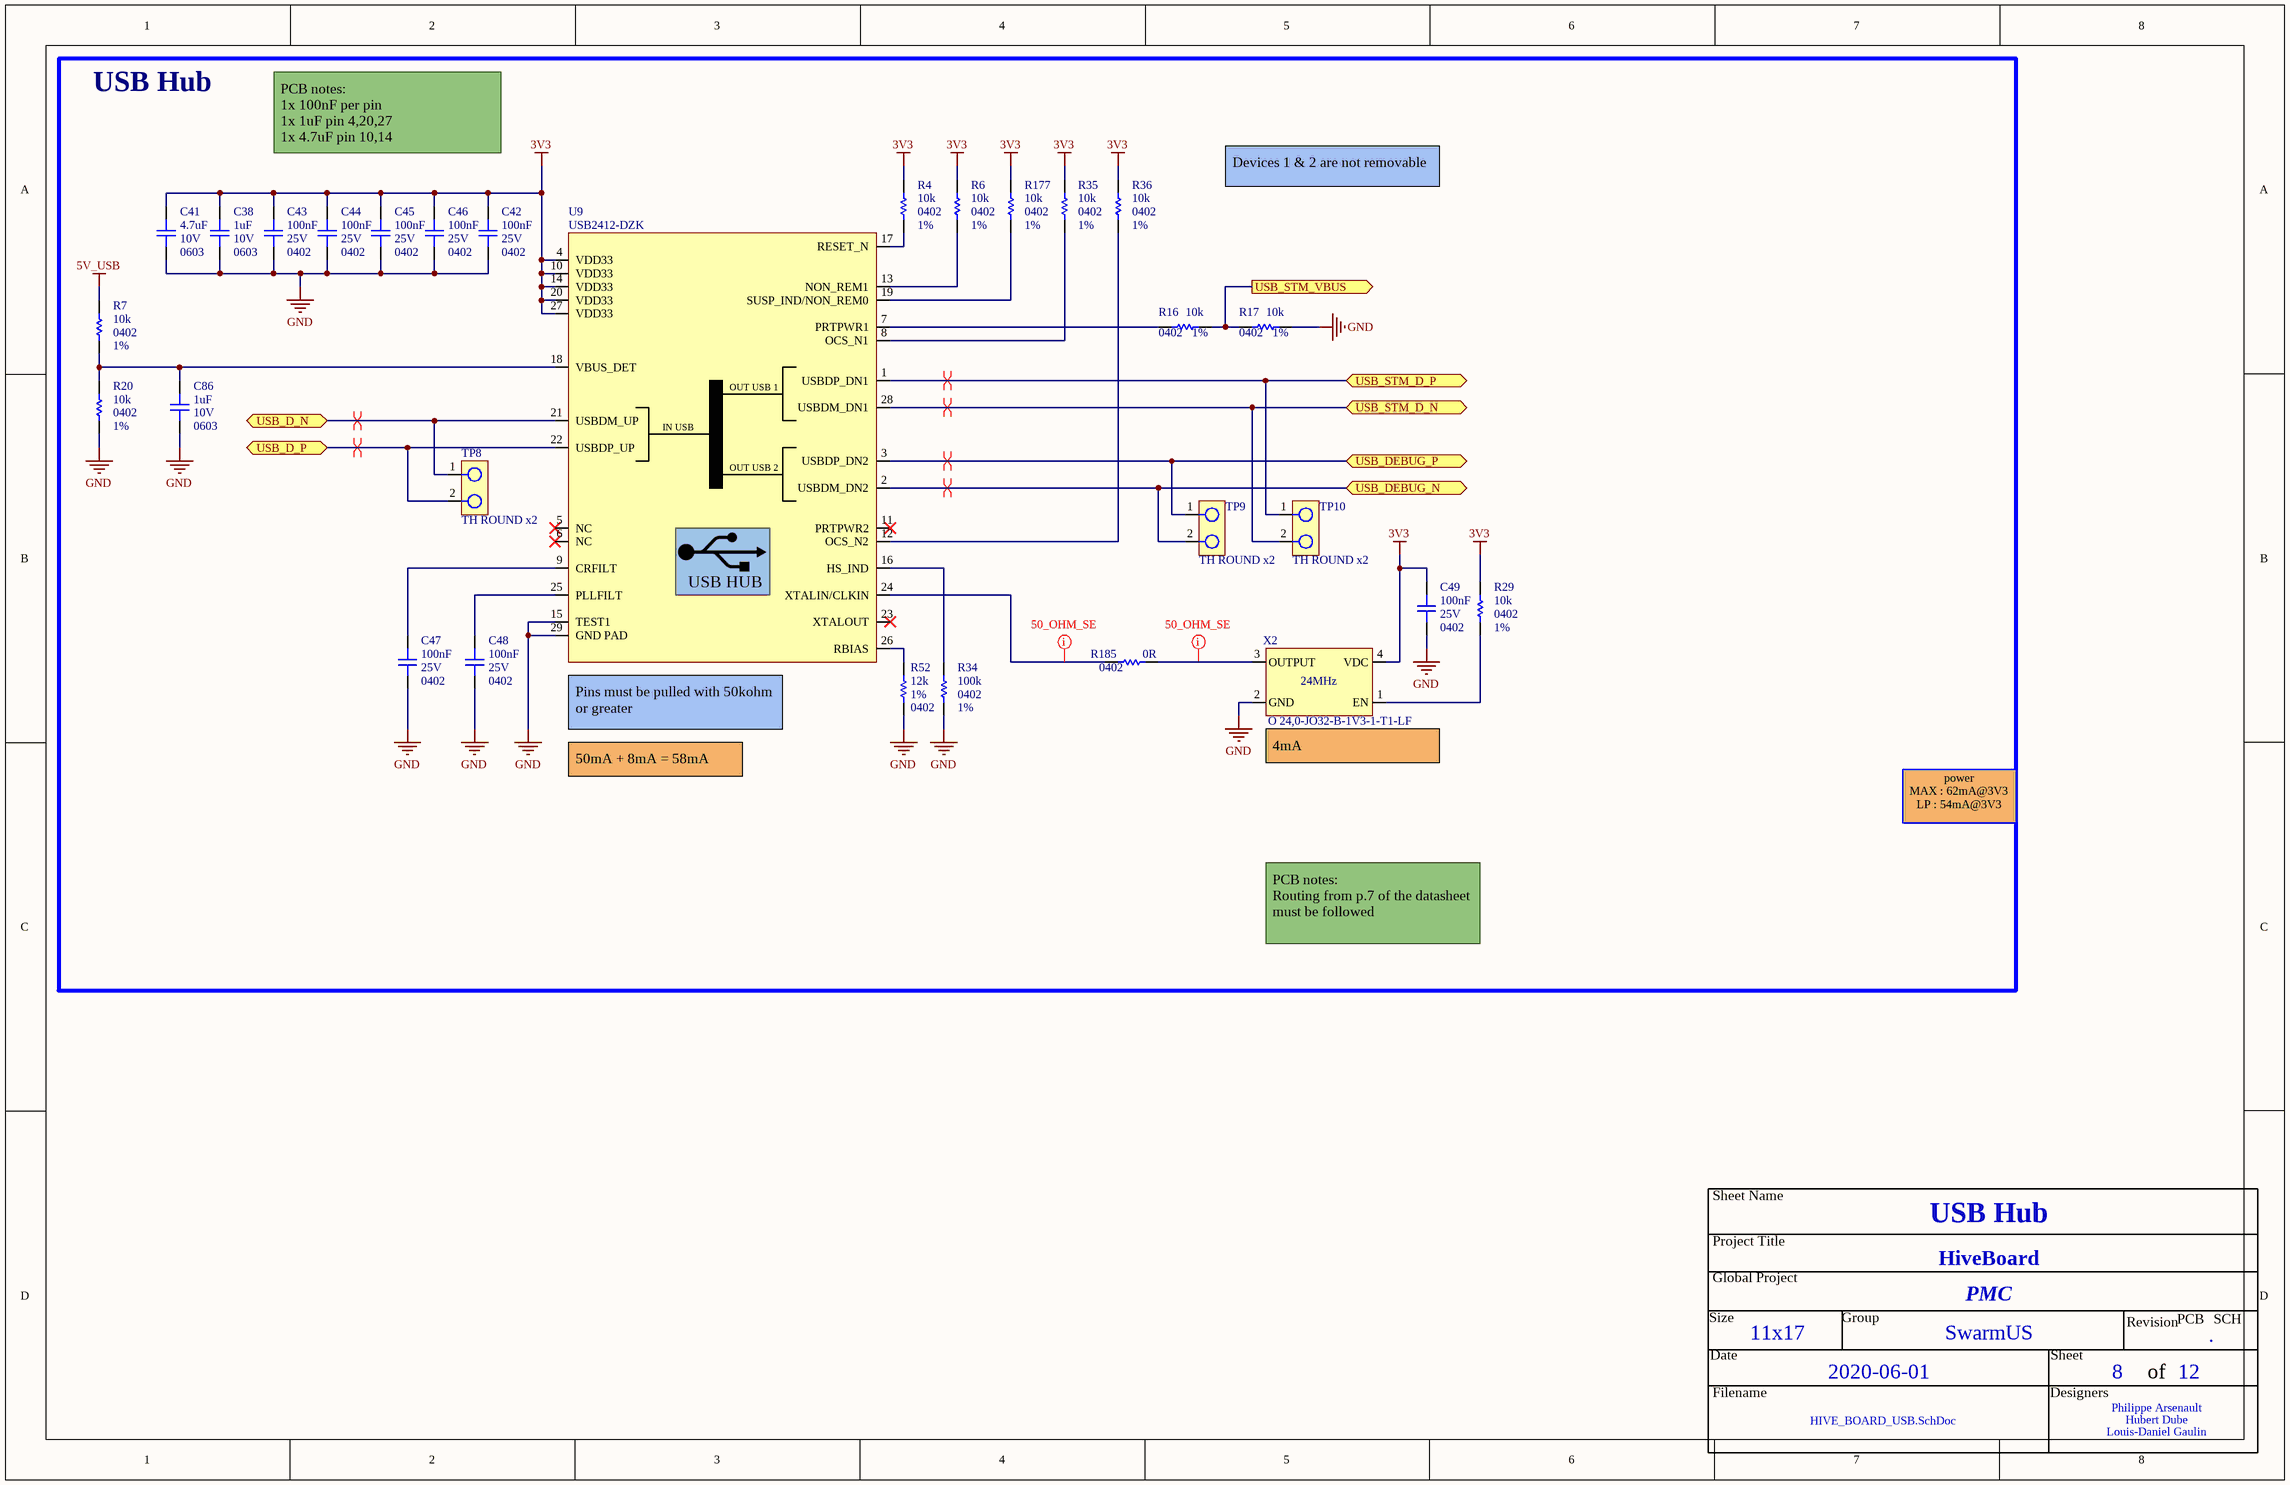
[diagram p10: HIVE_BOARD_USB.SchDoc]

### Parts
C38  value 1uF  Package: 0603  Voltage Rating: 10V  [CAP_CER_0603]  (hidden comment: C0603C105K8PACTU)
C41  value 4.7uF  Package: 0603  Voltage Rating: 10V  [CAP_CER_0603]  (hidden comment: CL10A475KP8NNNC)
C42  value 100nF  Package: 0402  Voltage Rating: 25V  [CAP_CER_0402]  (hidden comment: CGA2B3X7R1E104K050BB)
C43  value 100nF  Package: 0402  Voltage Rating: 25V  [CAP_CER_0402]  (hidden comment: CGA2B3X7R1E104K050BB)
C44  value 100nF  Package: 0402  Voltage Rating: 25V  [CAP_CER_0402]  (hidden comment: CGA2B3X7R1E104K050BB)
C45  value 100nF  Package: 0402  Voltage Rating: 25V  [CAP_CER_0402]  (hidden comment: CGA2B3X7R1E104K050BB)
C46  value 100nF  Package: 0402  Voltage Rating: 25V  [CAP_CER_0402]  (hidden comment: CGA2B3X7R1E104K050BB)
C47  value 100nF  Package: 0402  Voltage Rating: 25V  [CAP_CER_0402]  (hidden comment: CGA2B3X7R1E104K050BB)
C48  value 100nF  Package: 0402  Voltage Rating: 25V  [CAP_CER_0402]  (hidden comment: CGA2B3X7R1E104K050BB)
C49  value 100nF  Package: 0402  Voltage Rating: 25V  [CAP_CER_0402]  (hidden comment: CGA2B3X7R1E104K050BB)
C86  value 1uF  Package: 0603  Voltage Rating: 10V  [CAP_CER_0603]  (hidden comment: C0603C105K8PACTU)
R4  value 10k  Tolerance: 1%  Package: 0402  [RES_0402]  (hidden comment: RC0402FR-0710KL)
R6  value 10k  Tolerance: 1%  Package: 0402  [RES_0402]  (hidden comment: RC0402FR-0710KL)
R7  value 10k  Tolerance: 1%  Package: 0402  [RES_0402]  (hidden comment: RC0402FR-0710KL)
R16  value 10k  Tolerance: 1%  Package: 0402  [RES_0402]  (hidden comment: RC0402FR-0710KL)
R17  value 10k  Tolerance: 1%  Package: 0402  [RES_0402]  (hidden comment: RC0402FR-0710KL)
R20  value 10k  Tolerance: 1%  Package: 0402  [RES_0402]  (hidden comment: RC0402FR-0710KL)
R29  value 10k  Tolerance: 1%  Package: 0402  [RES_0402]  (hidden comment: RC0402FR-0710KL)
R34  value 100k  Tolerance: 1%  Package: 0402  [RES_0402]  (hidden comment: RC0402FR-07100KL)
R35  value 10k  Tolerance: 1%  Package: 0402  [RES_0402]  (hidden comment: RC0402FR-0710KL)
R36  value 10k  Tolerance: 1%  Package: 0402  [RES_0402]  (hidden comment: RC0402FR-0710KL)
R52  value 12k  Tolerance: 1%  Package: 0402  [RES_0402]  (hidden comment: RC0402FR-0712KL)
R177  value 10k  Tolerance: 1%  Package: 0402  [RES_0402]  (hidden comment: RC0402FR-0710KL)
R185  value 0R  Package: 0402  [RES_0402]  (hidden comment: RC0402FR-070RL)
TP8  TH ROUND x2  [TPO_TH_ROUND_0.7mm_DOUBLE]  (no BOM)
TP9  TH ROUND x2  [TPO_TH_ROUND_0.7mm_DOUBLE]  (no BOM)
TP10  TH ROUND x2  [TPO_TH_ROUND_0.7mm_DOUBLE]  (no BOM)
U9  USB2412-DZK  [USB_USB2412-DZK]
X2  O 24,0-JO32-B-1V3-1-T1-LF  [OSC_O 24,0-JO32-B-1V3-1-T1-LF]

### Blocks framed on the sheet
USB Hub: C38 C41-C49 C86 R4 R6 R7 R16 R17 R20 R29 R34-R36 R52 R177 R185 TP8-TP10 U9 X2

### Ports
USB_D_N (bidir), USB_D_P (bidir), USB_DEBUG_N (bidir), USB_DEBUG_P (bidir), USB_STM_D_N (bidir), USB_STM_D_P (bidir), USB_STM_VBUS (out)

### Nets
3V3: C38.1 C41.2 C42.2 C43.2 C44.2 C45.2 C46.2 C49.2 R4.1 R6.1 R29.1 R35.1 R36.1 R177.1 U9.4(VDD33) U9.10(VDD33) U9.14(VDD33) U9.20(VDD33) U9.27(VDD33) X2.4(VDC)
5V_USB: R7.1
GND: C38.2 C41.1 C42.1 C43.1 C44.1 C45.1 C46.1 C47.1 C48.1 C49.1 C86.2 R17.2 R20.2 R34.2 R52.1 U9.15(TEST1) U9.29(GND_PAD) X2.2(GND)
USB_D_N: TP8.1 U9.21(USBDM_UP) ; port USB_D_N
USB_D_P: TP8.2 U9.22(USBDP_UP) ; port USB_D_P
USB_DEBUG_N: TP9.2 U9.2(USBDM_DN2) ; port USB_DEBUG_N
USB_DEBUG_P: TP9.1 U9.3(USBDP_DN2) ; port USB_DEBUG_P
USB_STM_D_N: TP10.2 U9.28(USBDM_DN1) ; port USB_STM_D_N
USB_STM_D_P: TP10.1 U9.1(USBDP_DN1) ; port USB_STM_D_P
NetC47_2: C47.2 U9.9(CRFILT)
NetC48_2: C48.2 U9.25(PLLFILT)
NetC86_1: C86.1 R7.2 R20.1 U9.18(VBUS_DET)
NetR4_2: R4.2 U9.17(RESET_N)
NetR6_2: R6.2 U9.13(NON_REM1)
NetR16_1: R16.1 U9.7(PRTPWR1)
NetR16_2: R16.2 R17.1 ; port USB_STM_VBUS
NetR29_2: R29.2 X2.1(EN)
NetR34_1: R34.1 U9.16(HS_IND)
NetR35_2: R35.2 U9.8(OCS_N1)
NetR36_2: R36.2 U9.12(OCS_N2)
NetR52_2: R52.2 U9.26(RBIAS)
NetR177_2: R177.2 U9.19(SUSP_IND/NON_REM0)
NetR185_1: R185.1 X2.3(OUTPUT)
NetR185_2: R185.2 U9.24(XTALIN/CLKIN)

Not connected (* = marked no-connect by the designer): U9 5(NC)* 6(NC)* 11(PRTPWR2)* 23(XTALOUT)*

### Layout directives
differential pair; differential pair class DIFF_90: USB_D_N, USB_D_P, USB_DEBUG_N, USB_DEBUG_P, USB_STM_D_N, USB_STM_D_P
net class SE_50: NetR185_1, NetR185_2

### Notes on the sheet
- PCB notes:
  1x 100nF per pin
  1x 1uF pin 4,20,27
  1x 4.7uF pin 10,14
- Devices 1 & 2 are not removable
- (near U9) Pins must be pulled with 50kohm or greater
- (near X2) 4mA
- 50mA + 8mA = 58mA
- power
  MAX : 62mA@3V3
  LP : 54mA@3V3
- PCB notes:
  Routing from p.7 of the datasheet must be followed
- Sheet Name
- Project Title
- Global Project
- Size
- Date
- Group
- Sheet
- Revision
- of
- PCB
- .
- SCH
- Filename
- Designers
- (in symbol USB_USB2412-DZK) OUT USB 1; IN USB; OUT USB 2; USB HUB

### Library data of the parts
C38 C86 = CAP_CER_C0603C105K8PACTU: as C54 on sheet HIVE_BOARD_ETHERNET; Tolerance: 10%; Current Rating: *; Power Max: *; HelpURL: https://content.kemet.com/datasheets/KEM_C1006_X5R_SMD.pdf; CreatedBy/Date: Hubert Dube - 21/07/20; VerifiedBy: Louis-Daniel Gaulin - 21/07/20; Temperature: -55°C ~ 85°C; Manufacturer #2: *; Assembly Type: SMD; Part Number #2: *; Part Number #1: C0603C105K8PACTU; Cryo: UNKNOWN; Supplier 1: Digi-Key; Supplier Part Number 1: 399-3118-1-ND
C41 = CAP_CER_CL10A475KP8NNNC: 4.7µF ±10% 10V Ceramic Capacitor X5R 0603; Manufacturer #1: Samsung Electro-Mechanics; GRAMS Lib Spec: 2.8; Magnetic Material: Unknown; Polarized: No; Tolerance: 10%; Current Rating: *; Power Max: *; HelpURL: https://www.samsungsem.com/resources/file/global/support/product_catalog/MLCC.pdf; CreatedBy/Date: Hubert Dube - 25/02/2021; VerifiedBy: Philippe Arsenault/2021-03-14; Temperature: -55°C ~ 85°C; Manufacturer #2: *; Note: *; Assembly Type: SMD; Part Number #2: *; Part Number #1: CL10A475KP8NNNC; Cryo: UNKNOWN; Supplier 1: Digi-Key; Supplier Part Number 1: 1276-1044-1-ND
C42-C49 = CAP_CER_CGA2B3X7R1E104K050BB: as C34 on sheet HIVE_BOARD_ETHERNET; Assembly Type: SMD; CreatedBy/Date: Nicolas Roy 2018-11-07; Current Rating: *; HelpURL: https://product.tdk.com/info/en/catalog/datasheets/mlcc_automotive_general_en.pdf; Manufacturer #2: *; Note: *; Part Number #1: CGA2B3X7R1E104K050BB; Part Number #2: *; Power Max: *; Temperature: -55°C ~ 125°C; Tolerance: 10%; VerifiedBy: Nicolas V. (2019-01-22); Supplier 1: Digi-Key; Supplier Part Number 1: 445-6902-1-ND; Cryo: UNKNOWN
R4 R6 R7 R16 R17 R20 R29 R35 R36 R177 = RES_RC0402FR-0710KL: as R53 on sheet HIVE_BOARD_ETHERNET; Assembly Type: SMD; CreatedBy/Date: Nicolas V. (2018-11-20); Current Rating: *; HelpURL: http://www.yageo.com/documents/recent/PYu-RC_Group_51_RoHS_L_9.pdf; Manufacturer #2: *; Note: *; Part Number #1: RC0402FR-0710KL; Part Number #2: *; Power Max: 1/16W; Temperature: -55°C ~ 155°C; VerifiedBy: Nicolas V. (2018-11-20); Supplier 1: Digi-Key; Supplier Part Number 1: 311-10.0KLRCT-ND; Cryo: UNKNOWN; Solder Paste Type: UNKNOWN; Stencil Thickness (Recommended): UNKNOWN
R34 = RES_RC0402FR-07100KL: RES - 100K 1% 1/16W - 0402; Manufacturer #1: Yageo; GRAMS Lib Spec: 2.8; Magnetic Material: Unknown; Polarized: No; Voltage Rating: 50V; Assembly Type: SMD; CreatedBy/Date: Keven Deslandes 2018-10-19; Current Rating: *; HelpURL: http://www.yageo.com/documents/recent/PYu-RC_Group_51_RoHS_L_9.pdf; Manufacturer #2: *; Part Number #1: RC0402FR-07100KL; Part Number #2: *; Power Max: 1/16W; Temperature: -55°C ~ 155°C; VerifiedBy: Caroline Paulin - 18/12/2018; Supplier 1: Digi-Key; Supplier Part Number 1: 311-100KLRCT-ND; Cryo: UNKNOWN
R52 = RES_RC0402FR-0712KL: RES - 12k Ohms ±1% 0.063W, 1/16W Chip Resistor 0402 (1005 Metric) Moisture Resistant Thick Film; Manufacturer #1: Yageo; GRAMS Lib Spec: 2.8c; Magnetic Material: Unknown; Polarized: No; Voltage Rating: 50V; Assembly Type: SMD; CreatedBy/Date: Philippe Arsenault/2021-03-11; Current Rating: *; HelpURL: https://www.yageo.com/upload/media/product/productsearch/datasheet/rchip/PYu-RC_Group_51_RoHS_L_11.pdf; Manufacturer #2: *; Note: *; Part Number #1: RC0402FR-0712KL; Part Number #2: *; Power Max: 1/16W; Temperature: -55°C ~ 155°C; VerifiedBy: Hubert Dube - 19/03/2021; Supplier 1: Digi-Key; Supplier Part Number 1: 311-12.0KLRCT-ND
R185 = RES_RC0402FR-070RL: RES - 0R 1/16W 1A  - 0402; Manufacturer #1: Yageo; GRAMS Lib Spec: 2.8; Magnetic Material: Unknown; Polarized: No; Voltage Rating: 50V; Assembly Type: SMD; CreatedBy/Date: Keven Deslandes 2018-09-12; Current Rating: 1A; HelpURL: http://www.yageo.com/documents/recent/PYu-RC_Group_51_RoHS_L_10.pdf; Manufacturer #2: *; Note: *; Part Number #1: RC0402FR-070RL; Part Number #2: *; Power Max: 1/16W; Temperature: -55°C ~ 155°C; VerifiedBy: Caroline Paulin - 27 fév 2019; Supplier 1: Digi-Key; Supplier Part Number 1: 311-0.0LRCT-ND; Cryo: UNKNOWN
TP8-TP10 = TPO_TH_ROUND_0.7mm_DOUBLE: TPO - TH round 0.7mm double - 2-SMD; GRAMS Lib Spec: 2.8; Tolerance: -; Voltage Rating: -; Current Rating: -; Power Max: -; HelpURL: -; CreatedBy/Date: Philippe Arsenault / 20-04-2021; VerifiedBy: Louis-Daniel Gaulin / 29-04-2021; Temperature: -; Package: 2-SMD; Manufacturer #1: -; Manufacturer #2: -; Note: -; Assembly Type: TH; Part Number #2: -; Part Number #1: -; Magnetic Material: -; Polarized: -; Supplier 1: -; Supplier Part Number 1: -
U9 = USB_USB2412-DZK: USB Hub Controller USB 2.0 USB Interface 28-QFN; Manufacturer #1: Microchip Technology; Part Number #1: 638-1114-ND; Value: 2-PORTS; Voltage Rating: 3V ~ 3.6V; GRAMS Lib Spec: 2.7; Magnetic Material: Unknown; Polarized: Yes; Tolerance: *; Current Rating: *; Power Max: *; HelpURL: https://ww1.microchip.com/downloads/en/DeviceDoc/2412.pdf; VerifiedBy: Philippe Arsenault/2021-03-14; Temperature: 0°C ~ 70°C; Package: *; Manufacturer #2: *; Assembly Type: SMD; Part Number #2: *; CreatedBy/Date: Hubert Dube -  12/02/2021; Supplier 1: Digi-Key; Supplier Part Number 1: USB2412-DZK-CT-ND
X2 = OSC_O 24,0-JO32-B-1V3-1-T1-LF: OSC - 24MHz XO (Standard) LVCMOS Oscillator 1.8V ~ 3.3V Enable/Disable 4-SMD, No Lead; Manufacturer #1: Jauch Quartz; Tolerance: ±50ppm; Current Rating: 4mA; Power Max: 13mW; GRAMS Lib Spec: 2.8c; Magnetic Material: Unknown; Polarized: Yes; Value: 24MHz; Voltage Rating: 1.8V ~ 3.3V; HelpURL: https://www.jauch.com/downloadfile/5ef1edcfb8e2f73163c8ce8009ef659d1/jo32-1.8-3.3v.pdf; CreatedBy/Date: Louis-Daniel Gaulin / 13-04-2021; VerifiedBy: Philippe Arsenault/2021-04-14; Temperature: -40°C ~ +85°C; Package: 4-SMD, No Lead; Manufacturer #2: *; Note: *; Assembly Type: SMD; Part Number #2: *; Part Number #1: O 24,0-JO32-B-1V3-1-T1-LF; Cryo: UNKNOWN; Supplier 1: Digi-Key; Supplier Part Number 1: 1908-O240-JO32-B-1V3-1-T1-LFCT-ND